# Altium schematic sheet LED-driver adjustable on UCC28810.SchDoc: LED-Driver "Aigul-50W" v.2
size 594 x 420 mm; ApprovedBy: Лазарев В.П.; DrawnBy: Лазарев В.П.; SheetTotal: 1; PageSetup: Record=PageOptions|CenterHorizontal=True|CenterVertical=True|PrintScale=0.70|XCorrection=1.00|YCorrection=1.00|PrintKind=0|BorderSize=5000000|LeftOffset=0|BottomOffset=0|Orientation=2|PaperLength=1000|PaperWidth=1000|Scale=100|PaperSource=260|PrintQuality=600|MediaType=1|DitherType=10|PaperKind=A3|PrintScaleMode=1
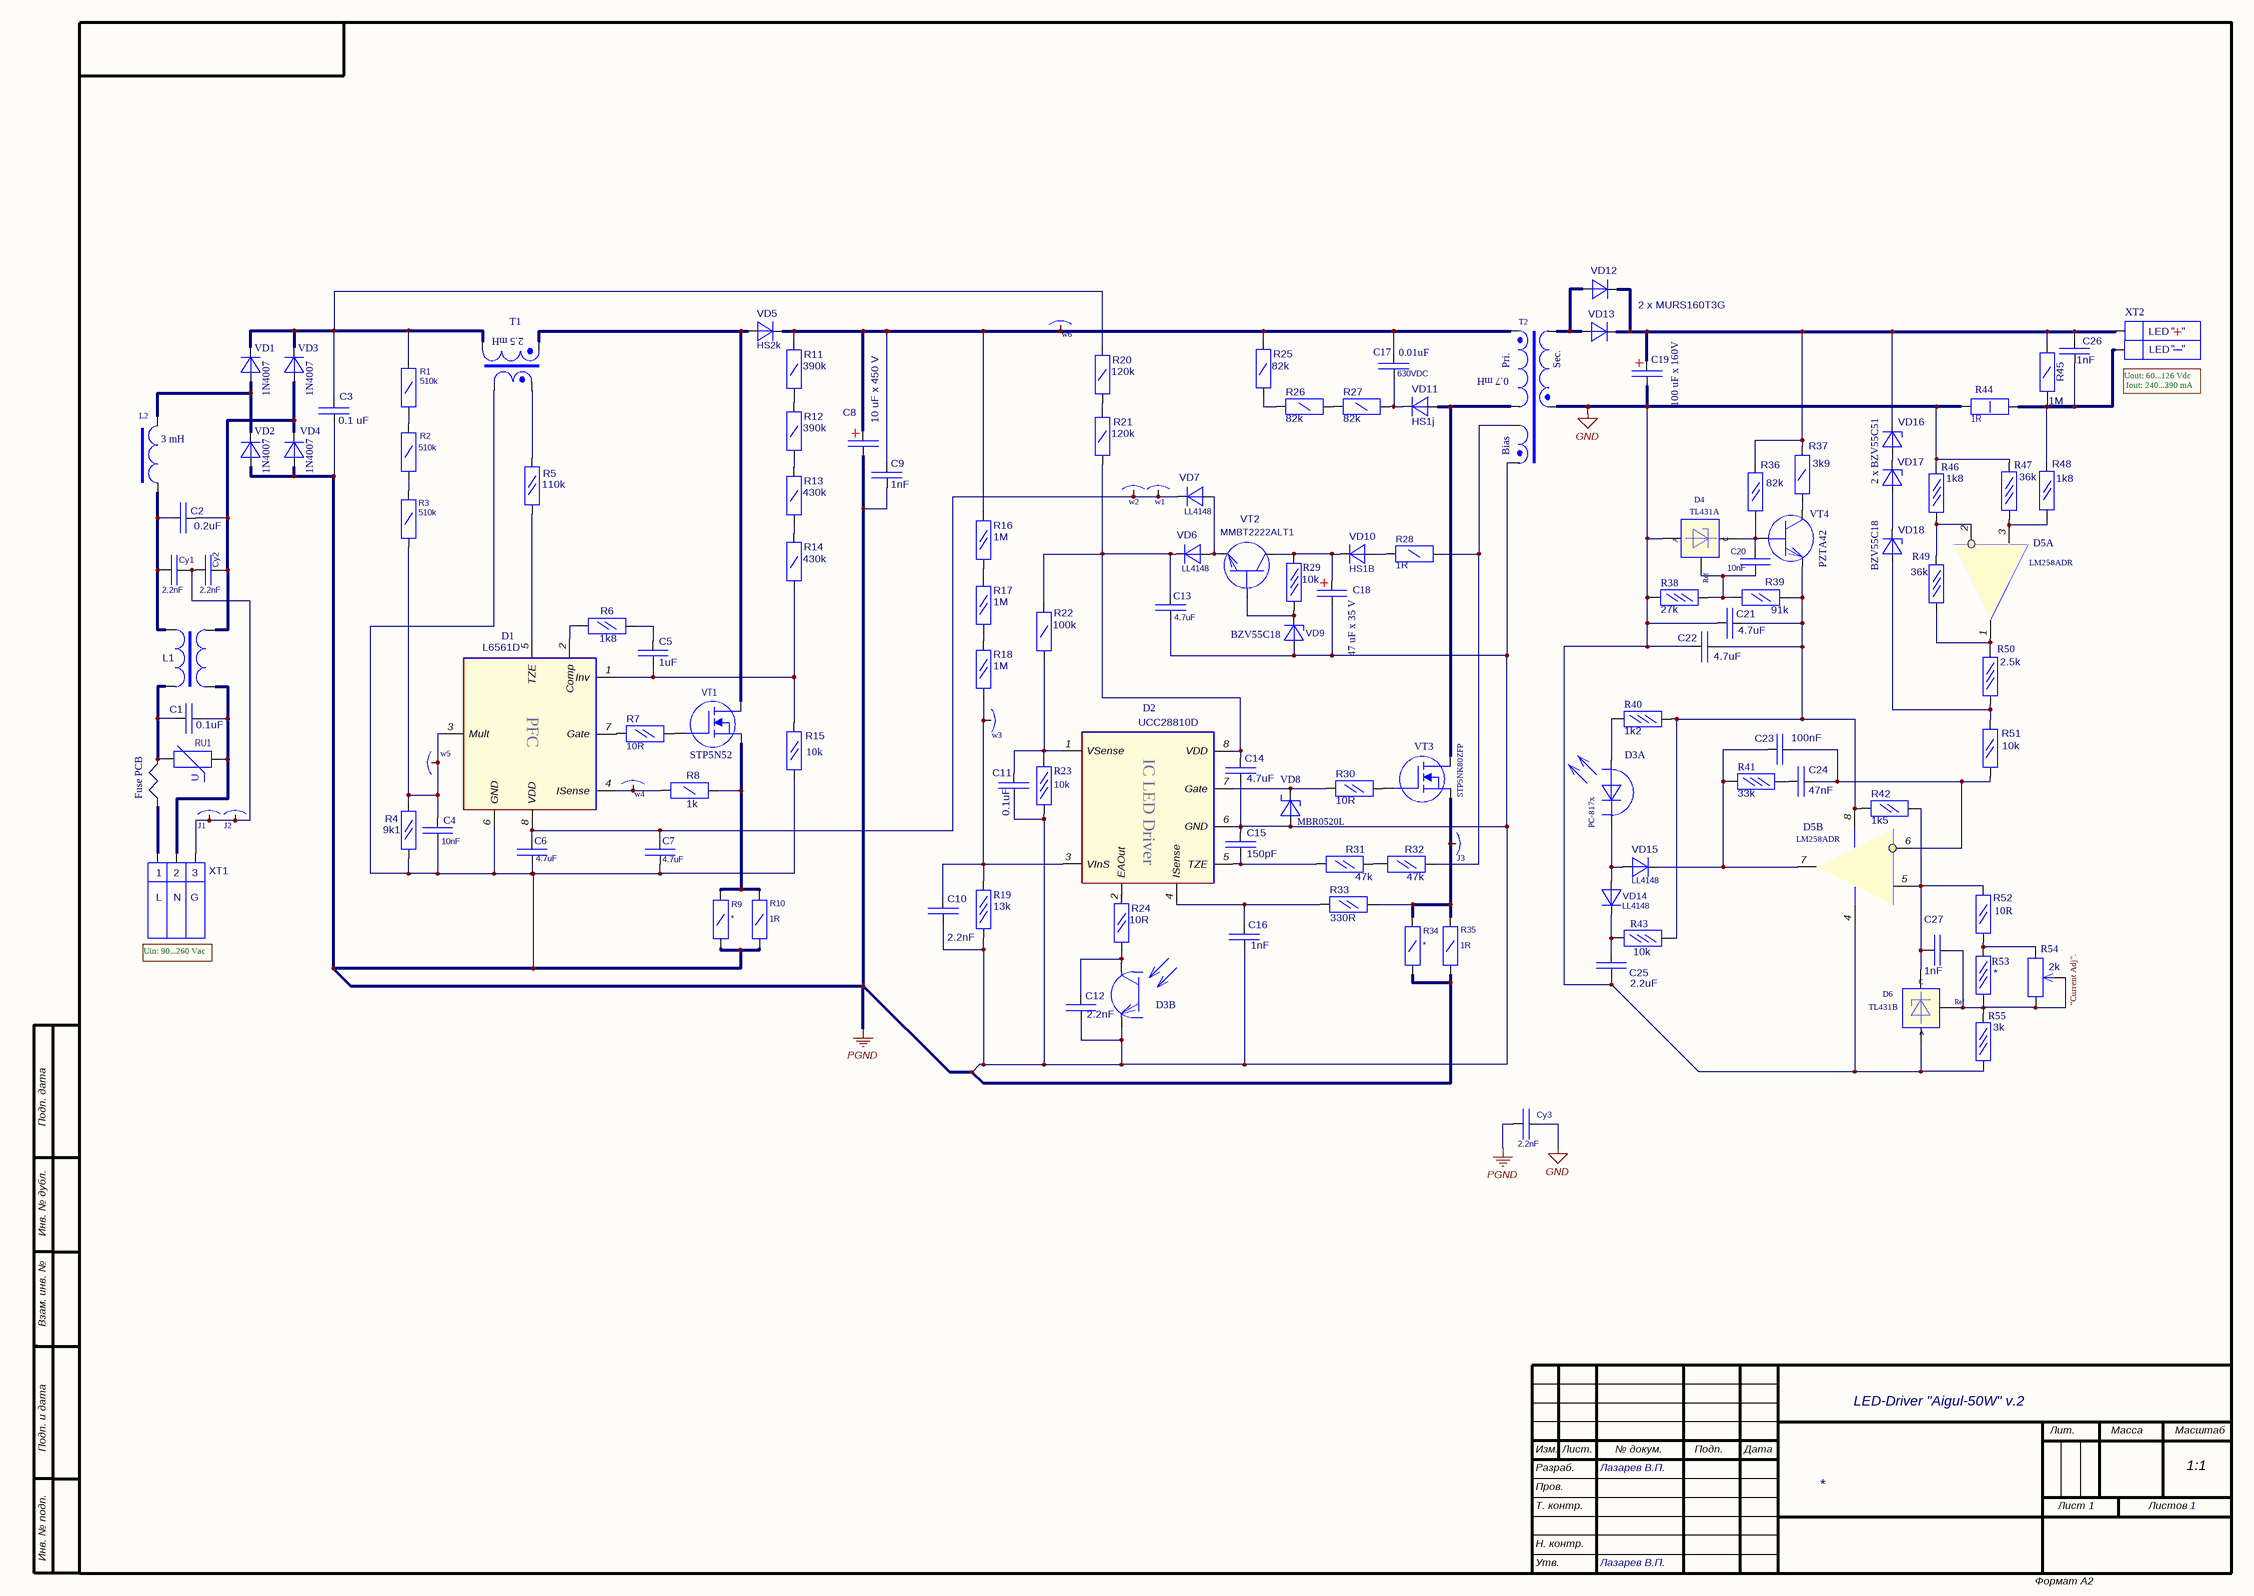
[diagram p0: LED-driver adjustable on UCC28810.SchDoc]

## Parts
C1  value 0.1uF  [CAPR9.0x18.0-15.0]  (hidden comment: Cap_MKP)
C2  value 0.2uF  [CAPR9.0x18.0-15.0]  (hidden comment: Cap_MKP)
C3  value 0.1 uF  [CAPR5.0x13.0-7.5]  (hidden comment: Cap1)
C4  value 10nF  [CAPC2012 (0805)]  (hidden comment: Cap_SMD)
C5  value 1uF  [1608[0603]]  (hidden comment: Cap_SMD)
C6  value 4.7uF  [CAPC2012 (0805)]  (hidden comment: Cap_SMD)
C7  value 4.7uF  [CAPC2012 (0805)]  (hidden comment: Cap_SMD)
C8  value 10 uF x 450 V  [CAPR E 10x12.5 pitch 5 - hor]  (hidden comment: Cap Pol)
C9  value 1nF  [CAPR5.0x13.0-5.0]  (hidden comment: Cap1)
C10  value 2.2nF  [1608[0603]]  (hidden comment: Cap_SMD)
C11  value 0.1uF  [1608[0603]]  (hidden comment: Cap_SMD)
C12  value 2.2nF  [1608[0603]]  (hidden comment: Cap_SMD)
C13  value 4.7uF  [CAPC2012 (0805)]  (hidden comment: Cap_SMD)
C14  value 4.7uF  [CAPC2012 (0805)]  (hidden comment: Cap_SMD)
C15  value 150pF  [1608[0603]]  (hidden comment: Cap_SMD)
C16  value 1nF  [1608[0603]]  (hidden comment: Cap_SMD)
C17  value 0.01uF  Voltage: 630VDC  [CAPC1812]  (hidden comment: Comment)
C18  value 47 uF x 35 V  [CAPR E 6.5x12, pitch 2.5]  (hidden comment: Comment)
C19  value 100 uF x 160V  [CAPR E 10x12.5 pitch 5 - hor]  (hidden comment: Cap Pol)
C20  value 10nF  [1608[0603]]  (hidden comment: Cap_SMD)
C21  value 4.7uF  [CAPC2012 (0805)]  (hidden comment: Cap_SMD)
C22  value 4.7uF  [CAPC3216N]  (hidden comment: Cap_SMD)
C23  value 100nF  [1608[0603]]  (hidden comment: Cap_SMD)
C24  value 47nF  [1608[0603]]  (hidden comment: Cap_SMD)
C25  value 2.2uF  [CAPC2012 (0805)]  (hidden comment: Cap_SMD)
C26  value 1nF  [CAPR5.0x13.0-5.0]  (hidden comment: Cap1)
C27  value 1nF  [CAPC2012 (0805)]  (hidden comment: Cap_SMD)
Cy1  value 2.2nF  [CAPR Y - 7.5]  (hidden comment: Cap (Y))
Cy2  value 2.2nF  [CAPR Y - 7.5]  (hidden comment: Cap (Y))
Cy3  value 2.2nF  [CAPR Y - 7.5]  (hidden comment: Cap (Y))
D1  value L6561D  [SO8_M]  (hidden comment: L6561)
D2  UCC28810D  [SO8_M]
D3  value PC-817x  [PC-817xx]  (hidden comment: Optocoupler)  (parts A,B of 2)
D4  value TL431A  [SOT-23_3D]  (hidden comment: TL431)
D5  value LM258ADR  [SO8_M]  (hidden comment: UCC28810D)  (parts A,B of 2)
D6  value TL431B  [SOT-23_3D]  (hidden comment: TL431)
J1  Jumper_1  [AXIAL- Jumper_9.5mm]  (value not drawn)  (net tie)
J2  Jumper_1  [AXIAL- Jumper_9.5mm]  (value not drawn)  (net tie)
J3  Jumper_1  [AXIAL- Jumper_15.0mm]  (value not drawn)  (net tie)
L1  Trans EMI  [YEE19-353D]  (value not drawn)
L2  3 mH  [Choke Barbell]
R1  value 510k  [RESC3216(1206)N]  (hidden comment: Res 1/4W)
R2  value 510k  [RESC3216(1206)N]  (hidden comment: Res 1/4W)
R3  value 510k  [RESC3216(1206)N]  (hidden comment: Res 1/4W)
R4  value 9k1  [RESC2012(0805)]  (hidden comment: Res 1/8W)
R5  value 110k  [RESC2012(0805)]  (hidden comment: Res 1/8W)
R6  value 1k8  [RESC2012(0805)]  (hidden comment: Res 1/8W)
R7  value 10R  [RESC2012(0805)]  (hidden comment: Res 1/8W)
R8  value 1k  [RESC3216(1206)N]  (hidden comment: Res 1/4W)
R9  Res 1/4W  [RESC3216(1206)N]  (value not drawn)
R10  value 1R  [RESC3216(1206)N]  (hidden comment: Res 1/4W)
R11  value 390k  [RESC3216(1206)N]  (hidden comment: Res 1/4W)
R12  value 390k  [RESC3216(1206)N]  (hidden comment: Res 1/4W)
R13  value 430k  [RESC3216(1206)N]  (hidden comment: Res 1/4W)
R14  value 430k  [RESC3216(1206)N]  (hidden comment: Res 1/4W)
R15  Value2: 10k  [RESC2012(0805)]  (hidden comment: Res 1/8W)
R16  value 1M  [RESC2012(0805)]  (hidden comment: Res 1/8W)
R17  value 1M  [RESC2012(0805)]  (hidden comment: Res 1/8W)
R18  value 1M  [RESC2012(0805)]  (hidden comment: Res 1/8W)
R19  value 13k  [RESC1608(0603)]  (hidden comment: Res 1/16W)
R20  value 120k  [RESC3216(1206)N]  (hidden comment: Res 1/4W)
R21  value 120k  [RESC3216(1206)N]  (hidden comment: Res 1/4W)
R22  value 100k  [RESC3216(1206)N]  (hidden comment: Res 1/4W)
R23  value 10k  [RESC1608(0603)]  (hidden comment: Res 1/16W)
R24  value 10R  [RESC2012(0805)]  (hidden comment: Res 1/8W)
R25  value 82k  [RESC3216(1206)N]  (hidden comment: Res 1/4W)
R26  value 82k  [RESC3216(1206)N]  (hidden comment: Res 1/4W)
R27  value 82k  [RESC3216(1206)N]  (hidden comment: Res 1/4W)
R28  value 1R  [RESC3216(1206)N]  (hidden comment: Res 1/4W)
R29  value 10k  [RESC1608(0603)]  (hidden comment: Res 1/16W)
R30  value 10R  [RESC2012(0805)]  (hidden comment: Res 1/8W)
R31  value 47k  [RESC2012(0805)]  (hidden comment: Res 1/8W)
R32  value 47k  [RESC2012(0805)]  (hidden comment: Res 1/8W)
R33  value 330R  [RESC2012(0805)]  (hidden comment: Res 1/8W)
R34  Res 1/4W  [RESC3216(1206)N]  (value not drawn)
R35  value 1R  [RESC3216(1206)N]  (hidden comment: Res 1/4W)
R36  value 82k  [RESC2012(0805)]  (hidden comment: Res 1/8W)
R37  value 3k9  [RESC3216(1206)N]  (hidden comment: Res 1/4W)
R38  value 27k  [RESC1608(0603)]  (hidden comment: Res 1/16W)
R39  value 91k  [RESC2012(0805)]  (hidden comment: Res 1/8W)
R40  value 1k2  [RESC1608(0603)]  (hidden comment: Res 1/16W)
R41  value 33k  [RESC1608(0603)]  (hidden comment: Res 1/16W)
R42  value 1k5  [RESC2012(0805)]  (hidden comment: Res 1/8W)
R43  value 10k  [RESC1608(0603)]  (hidden comment: Res 1/16W)
R44  value 1R  [RESC6332]  (hidden comment: Res 1W)
R45  value 1M  [RESC3216(1206)N]  (hidden comment: Res 1/4W)
R46  value 1k8  [RESC1608(0603)]  (hidden comment: Res 1/16W)
R47  value 36k  [RESC1608(0603)]  (hidden comment: Res 1/16W)
R48  value 1k8  [RESC2012(0805)]  (hidden comment: Res 1/8W)
R49  value 36k  [RESC1608(0603)]  (hidden comment: Res 1/16W)
R50  value 2.5k  [RESC1608(0603)]  (hidden comment: Res 1/16W)
R51  value 10k  [RESC2012(0805)]  (hidden comment: Res 1/8W)
R52  value 10R  [RESC2012(0805)]  (hidden comment: Res 1/8W)
R53  Res 1/16W  [RESC1608(0603)]  (value not drawn)
R54  value 2k  Function: "Current Adj".  [RES-Trim_3362H]  (hidden comment: Res Trimm)
R55  value 3k  [RESC1608(0603)]  (hidden comment: Res 1/16W)
RU1  Varistor  [VAristor 7.5-11x5]  (value not drawn)
T1  YEE25-2.5  [YEE25-2.5]  (value not drawn)
T2  FB-E25/50W  [FB-E25/50W]  (value not drawn)
VD1  value 1N4007  [CD4532-1812 (mod)]
VD2  value 1N4007  [CD4532-1812 (mod)]
VD3  value 1N4007  [CD4532-1812 (mod)]  (hidden comment: Diode HS1x)
VD4  value 1N4007  [CD4532-1812 (mod)]
VD5  value HS2k  [CD4532-1812 (mod)]  (hidden comment: Diode1)
VD6  value LL4148  [MELF-D3516-1406]  (hidden comment: Diode LL4148)
VD7  value LL4148  [MELF-D3516-1406]  (hidden comment: Diode LL4148)
VD8  value MBR0520L  [SOD123]  (hidden comment: Diode Schottky)
VD9  value BZV55C18  [MELF-D3516-1406]  (hidden comment: Diode Zener)
VD10  value HS1B  [CD4532-1812 (mod)]  (hidden comment: Diode1)
VD11  value HS1j  [CD4532-1812 (mod)]  (hidden comment: Diode1)
VD12  value 2 x MURS160T3G  [CD4532-1812 (mod)]  (hidden comment: Diode1)
VD13  Diode1  [CD4532-1812 (mod)]  (value not drawn)
VD14  value LL4148  [MELF-D3516-1406]  (hidden comment: Diode LL4148)
VD15  value LL4148  [MELF-D3516-1406]  (hidden comment: Diode LL4148)
VD16  value 2 x BZV55C51  [MELF-D3516-1406]  (hidden comment: Diode Zener)
VD17  Diode Zener  [MELF-D3516-1406]  (value not drawn)
VD18  value BZV55C18  [MELF-D3516-1406]  (hidden comment: Diode Zener)
VT1  value STP5N52  [D-PAK (TO252)]  (hidden comment: MOSFET-N1)
VT2  value MMBT2222ALT1  [SOT-23_3D]  (hidden comment: BC847)
VT3  value STP5NK80ZFP  [TO-220-AB (MOSFET)]  (hidden comment: MOSFET-N1)
VT4  PZTA42  [SOT223_M]
w1  Jumper_1  [Jumper-RES 0805]  (value not drawn)  (net tie)
w2  Jumper_1  [Jumper-RES 0805]  (value not drawn)  (net tie)
w3  Jumper_1  [Jumper-Res 1206]  (value not drawn)  (net tie)
w4  Jumper_1  [Jumper-Res 1206]  (value not drawn)  (net tie)
w5  Jumper_1  [Jumper-RES 0805]  (value not drawn)  (net tie)
w6  Jumper_1  [Jumper-Res 1206]  (value not drawn)  (net tie)
XT1  Connect x3  [ZIP-Ballast3]  (value not drawn)
XT2  Connect x2  [ZIP-Ballast2]  (value not drawn)

## Nets
GND: C19.2 C21.1 C22.2 C25.1 Cy3.2 D4.3(Anode) D5.4(V-) D6.3(Anode) R38.1 R44.1 R46.1 R47.1 R55.2 T2.6(Sec-)
PGND: C3.1 C4.1 C6.1 C7.1 C8.2 C9.2 C10.1 C11.1 C12.1 C13.1 C14.1 C15.1 C16.1 C18.2 Cy3.1 D1.6(GND) D2.6(GND) D3.3(Emitter) R4.2 R9.1 R10.1 R15.2 R19.2 R23.2 R34.1 R35.1 T1.4(Sec-) T2.5(TZE-) VD2.1 VD4.1 VD8.1(Anode) VD9.1
NetC1_1: C1.1 L1.4(Pri+) RU1.1 XT1.2
NetC1_2: C1.2 L1.1(Sec+) RU1.2 XT1.1
NetC2_1: C2.1 Cy2.2 L1.3(Pri-) VD3.1 VD4.2
NetC2_2: C2.2 Cy1.1 L1.2(Sec-) L2.1(Pri+)
NetC3_2: C3.2 R1.1 R20.2 T1.5(Pri-) VD1.2 VD3.2
NetC4_2: C4.2 D1.3(Mult) R3.2 R4.1 w5.1(W*)
NetC5_1: C5.1 R6.1
NetC5_2: C5.2 D1.1(Inv) R14.1 R15.1
NetC6_2: C6.2 C7.2 D1.8(VDD) VD7.2 w1.1(W*) w2.1(W*)
NetC8_1: C8.1 C9.1 C17.1 R11.2 R16.1 R25.2 T2.1(Pri-) VD5.2 w6.1(W*)
NetC10_2: C10.2 D2.3(VInS) R18.2 R19.1 w3.1(W*)
NetC11_2: C11.2 D2.1(VSense) R22.2 R23.1
NetC12_2: C12.2 D3.4(Collector) R24.2
NetC13_2: C13.2 C14.2 D2.8(VDD) R21.1 R22.1 VD6.2
NetC15_2: C15.2 D2.5(TZE) R31.1
NetC16_2: C16.2 D2.4(ISense) R33.1
NetC17_2: C17.2 R27.1 VD11.2
NetC18_1: C18.1 R29.1 VD10.2 VT2.3(C)
NetC19_1: C19.1 C26.2 R36.1 R37.2 R45.2 VD12.2 VD13.2 VD16.2 XT2.2
NetC20_1: C20.1 D4.1(Cathode) R36.2 VT4.1(B)
NetC20_2: C20.2 D4.2(Ref) R38.2 R39.1
NetC21_2: C21.2 C22.1 D5.8(V+) R39.2 R40.2 R42.2 R43.2 VT4.3(E)
NetC23_1: C23.1 C24.1 D5.6(IN-) R51.1
NetC23_2: C23.2 D5.7(OUT) R41.1 VD15.2
NetC24_2: C24.2 R41.2
NetC25_2: C25.2 R43.1 VD14.2
NetC26_1: C26.1 R44.2 R45.1 R48.1 XT2.1
NetC27_1: C27.1 D5.5(IN+) D6.1(Cathode) R42.1 R52.1
NetC27_2: C27.2 D6.2(Ref) R53.2 R54.2(WIPER) R54.3(CCW) R55.1
NetCy1_2: Cy1.2 Cy2.1 J1.1(W*) J2.1(W*) XT1.3
NetD1_2: D1.2(Comp) R6.2
NetD1_4: D1.4(ISense) R8.2 w4.1(W*)
NetD1_5: D1.5(TZE) R5.2
NetD1_7: D1.7(Gate) R7.2
NetD2_2: D2.2(EAOut) R24.1
NetD2_7: D2.7(Gate) R30.2 VD8.2(Catode)
NetD3_1: D3.1(Led_Anode) R40.1
NetD3_2: D3.2(Led_Cathode) VD14.1 VD15.1
NetD5_1: D5.1(OUT) R49.2 R50.1
NetD5_2: D5.2(IN-) R46.2 R49.1
NetD5_3: D5.3(IN+) R47.2 R48.2
NetJ3_1: J3.1(W*) R33.2 R34.2 R35.2 VT3.3(S)
NetL2_2: L2.2(Pri-) VD1.1 VD2.2
NetR1_2: R1.2 R2.1
NetR2_2: R2.2 R3.1
NetR5_1: R5.1 T1.1(Sec+)
NetR7_1: R7.1 VT1.1(G)
NetR8_1: R8.1 R9.2 R10.2 VT1.3(S)
NetR11_1: R11.1 R12.2
NetR12_1: R12.1 R13.2
NetR13_1: R13.1 R14.2
NetR16_2: R16.2 R17.1
NetR17_2: R17.2 R18.1
NetR20_1: R20.1 R21.2
NetR25_1: R25.1 R26.2
NetR26_1: R26.1 R27.2
NetR28_1: R28.1 R32.2 T2.4(TZE+)
NetR28_2: R28.2 VD10.1
NetR29_2: R29.2 VD9.2 VT2.1(B)
NetR30_1: R30.1 VT3.1(G)
NetR31_2: R31.2 R32.1
NetR37_1: R37.1 VT4.2(C)
NetR50_2: R50.2 R51.2 VD18.1
NetR52_2: R52.2 R53.1 R54.1(CW)
NetT1_8: T1.8(Pri+) VD5.1 VT1.2(D)
NetT2_3: T2.3(Pri+) VD11.1 VT3.2(D)
NetT2_10: T2.10(Sec+) VD12.1 VD13.1
NetVD6_1: VD6.1 VD7.1 VT2.2(E)
NetVD16_1: VD16.1 VD17.2
NetVD17_1: VD17.1 VD18.2

Not connected (* = marked no-connect by the designer): T1 6 7

## Notes on the sheet
- (near T1) 2.5 mH
- (near XT2) LED
- "
- +
- _
- (near T2) 0.7 mH
- (near T2) Pri.
- (near T2) Sec.
- (near XT2) Uout: 60...126 Vdc
  Iout: 240...390 mA
- (near T2) Bias
- (near RU1) Fuse PCB
- (near XT1) 1
- (near XT1) 2
- (near XT1) 3
- (near XT1) L
- (near XT1) N
- (near XT1) G
- Uin: 90...260 Vac
- Подп. дата
- Инв. № дубл.
- Взам. инв. №
- Подп. и дата
- Изм.
- Лист.
- № докум.
- Подп.
- Дата
- Лит.
- Масса
- Масштаб
- Разраб.
- Пров.
- Т. контр.
- Лист 1
- Листов
- 1:1
- Инв. № подп.
- Н. контр.
- Утв.
- Формат А2
- (in symbol TL431) A; C
- (in symbol Varistor) U

## Library data of the parts
C1 = Cap_MKP: Cap DIP (MKP); Voltage: 275VAC/400VDC; Function: EMI Filter; Tolerance: 20%; Dielectric: Polypropylene (MKP) - X2 class; PackageDescription: Radial, Thru-Hole Body 9.0x18.0x18.0mm(WxLxH), Pin Spacing 15.0mm; Supplier 1: *; Supplier Part Number 1: *
C2 = Cap_MKP: Cap DIP (MKP); Voltage: 275VAC/400VDV; Function: EMI Filter; Tolerance: 20%; Dielectric: Polypropylene (MKP) - X2 class; PackageDescription: Radial, Thru-Hole Body 9.0x18.0x18.0mm(WxLxH), Pin Spacing 15.0mm; Supplier 1: *; Supplier Part Number 1: *
C3 = Cap1: Capacitor GOST; Voltage: 400 VDC; Dielectric: Polypropylene Film; Tolerance: 10%; PackageDescription: Radial Capasitor
C4-C7 C10 C11 C13-C15 C21-C25 C27 = Cap_SMD: Ceramic; Voltage: 25Vdc; Tolerance %: 10%; Dielectric: X7R; Function: *; Supplier: *; Supplier Part Number: *
  C4 C13: PackageDescription: SMD CC1206/CC0805
  C5 C10 C11 C14 C15: PackageDescription: SMD CC0603
  C6 C7 C21-C25 C27: PackageDescription: SMD CC0805
C8 C18 = Cap Pol: Cap Pol GOST; Tolerance: 10%; Function: Electrolytic Aluminum Capasitor; Supplier: *; PackageDescription: Radial, Thru-Hole Body 13.0x25.0 (DxH)mm, Pin Spacing 5.0mm
C9 = Cap1: Capacitor GOST; Voltage: 1kV; Tolerance: 10 %; Dielectrik: Polypropyline Film; PackageDescription: Radial Capacitor; Package Reference: Capacitor class X 2,Thru-Hole Body 5.0 x 13.0 mm (WxT) Pin Spacing 5.0 mm; Function: *; Part Number: *; Supplier: *; Supplier Part Number: *
C12 C20 = Cap_SMD: Ceramic; Voltage: 25V; Tolerance %: 10%; Dielectric: X7R; PackageDescription: SMD CC0805; Function: *; Supplier: *; Supplier Part Number: *
C16 = Cap_SMD: Ceramic; Voltage: 50Vdc; Tolerance %: 10%; Dielectric: X7R; PackageDescription: SMD CC0603; Function: *; Supplier: *; Supplier Part Number: *
C17 = Cap1: Capacitor GOST; Tolerance: 10 %; Dielectrik: Ceramic; PackageDescription: SMD Capacitor; Package Reference: CC2220; Function: *; Part Number: *; Supplier: *; Supplier Part Number: *
C19 = Cap Pol: Cap Pol GOST; Tolerance: 10%; Function: 0; Supplier: *; PackageDescription: Radial, Thru-Hole Body 18.0x35.0 (DxH)mm, Pin Spacing 7.5mm
C26 = Cap1: Capacitor GOST; Voltage: 300Vdc; Tolerance: 10 %; Dielectrik: Polypropyline; PackageDescription: Radial Capacitor; Package Reference: Capacitor class X 2,Thru-Hole Body 5.0 x 13.0 mm (WxT) Pin Spacing 5.0 mm; Function: *; Part Number: *; Supplier: *; Supplier Part Number: *
Cy1-Cy3 = Cap (Y): Disc Ceramic; Voltage: 275VAC/400VDV; Function: Y-capacitor; Tolerance %: 20%; Dielectric: Ceramic Y1-class; PackageDescription: Radial, Disc Body , Pin Spacing 7.5mm; Supplier 1: *; Supplier Part Number 1: *
D1 = L6561: PFC; Functuion: PFC Controller; PackageReference: SOIC8; Supplier: STM
D2 = UCC28810D: IC LED Driver; Functuion: LED-Driver Controller; PackageReference: SOIC8; Supplier: Texac Instrument; Value: UCC28810D
D3 = Optocoupler: Phototransistor Optocoupler; Function: OptoIsolator/OptoCouple; PackageReference: SMD 4 pin
D4 = TL431: Prog Pre Ref_GOST; Function: Programmable Precision Reference; Tolerance: 1%; PackageReference: *; PackageDescription: SOT 23-3; Part Number: *
D5 = LM258ADR: Dual Operational Amplifier; Function: Low Power Dual OpAm; PackageDescription: SOIC-8 (8-Pin Small Outline Integrated Circuit 1.27 mm )
D6 = TL431: Prog Pre Ref_GOST; Function: Programmable Precision Reference; Tolerance: 0.5%; PackageReference: *; PackageDescription: SOT 23-3; Part Number: *
J1-J3 = Jumper_1: Jumper Wire; Function: Wire Jumper
  J1 J2: PackageDescription: Axial Jumper 9.5mm, Thru-Hole; 2 Leads
  J3: PackageDescription: Axial Jumper 15mm, Thru-Hole; 2 Leads
L1 = Trans EMI: Trans EMI (GOST); Function: EMI Filter; Value: YEE19-35D; Value2: 350mH; PackageDescription: *
L2 = Choke Barbell: Barbell 10 mm(d); PartNumber: IPK1016K302TU; Function: Choke EMI; PackageDescription: Barbell 11mm D; Value: 3 mH
R1-R3 R11-R14 = Res 1/4W: Resistor GOST; Tolerance: 5%; Voltage: 200Vdc; PackageReference: *; Function: *; Part Number: *
  R1-R3: PackageDescription: Chip Resistor, Body 3.2x1.6mm.
  R11-R14: PackageDescription: Chip Resistor, Body 3.2x1.6mm,
R4 = Res 1/8W: Resistor GOST; Tolerance: 1%; Voltage: 5Vdc; PackageDescription: Chip Resistor, Body 2.0x1.3mm,; PackageReference: *; Part Number: *
R5 R7 R30 R33 = Res 1/8W: Resistor GOST; Tolerance: 10%; Voltage: 50Vdc; PackageDescription: Chip Resistor, Body 2.0x1.3mm,; PackageReference: *; Part Number: *
R6 = Res 1/8W: Resistor GOST; Tolerance: 5%; Voltage: 25Vdc; PackageDescription: Chip Resistor, Body 2.0x1.3mm,; PackageReference: *; Part Number: *
R8 R22 R28 R35 = Res 1/4W: Resistor GOST; Tolerance: 10%; Voltage: 50Vdc; PackageDescription: Chip Resistor, Body 3.2x1.6mm.; PackageReference: *; Function: *; Part Number: *
R9 R34 = Res 1/4W: Resistor GOST; Tolerance: 10%; PackageDescription: Chip Resistor, Body 3.2x1.6mm.; PackageReference: *; Function: *; Part Number: *; Value: *
R10 = Res 1/4W: Resistor GOST; Tolerance: 5%; Voltage: 50Vdc; PackageDescription: Chip Resistor, Body 3.2x1.6mm.; PackageReference: *; Function: *; Part Number: *
R15 = Res 1/8W: Resistor GOST; Value: 10k6; Tolerance: 1%; Voltage: 50Vdc; PackageDescription: Chip Resistor, Body 2.0x1.3mm,; PackageReference: *; Part Number: *
R16-R18 = Res 1/8W: Resistor GOST; Tolerance: 5%; Voltage: 200Vdc; PackageDescription: Chip Resistor, Body 2.0x1.3mm,; PackageReference: *; Part Number: *
R19 R38 R41 R46 R47 R49 R50 = Res 1/16W: CR0603 GOST; Tolerance: 1%; Voltage: 25Vdc; PackageDescription: Chip 0603; PackageReference: RC0603; Part Number: *
R20 R21 = Res 1/4W: Resistor GOST; Tolerance: 10%; Voltage: 400Vdc; PackageDescription: Chip Resistor, Body 3.2x1.6mm,; PackageReference: *; Function: *; Part Number: *
R23 R40 = Res 1/16W: CR0603 GOST; Tolerance: 5%; Voltage: 25Vdc; PackageDescription: Chip 0603; PackageReference: RC0603; Part Number: *
R24 = Res 1/8W: Resistor GOST; Tolerance: 10%; Voltage: 25Vdc; PackageDescription: Chip Resistor, Body 2.0x1.3mm,; PackageReference: *; Part Number: *
R25-R27 R37 = Res 1/4W: Resistor GOST; Tolerance: 10%; Voltage: 200Vdc; PackageReference: *; Function: *; Part Number: *
  R25-R27: PackageDescription: Chip Resistor, Body 3.2x1.6mm,
  R37: PackageDescription: Chip Resistor, Body 3.2x1.6mm.
R29 R43 = Res 1/16W: CR0603 GOST; Tolerance: 10%; Voltage: 25Vdc; PackageDescription: Chip 0603; PackageReference: RC0603; Part Number: *
R31 R32 R39 R48 = Res 1/8W: Resistor GOST; Tolerance: 1%; Voltage: 50Vdc; PackageDescription: Chip Resistor, Body 2.0x1.3mm,; PackageReference: *; Part Number: *
R36 = Res 1/8W: Resistor GOST; Tolerance: 1%; Voltage: 200Vdc; PackageDescription: Chip Resistor, Body 2.0x1.3mm,; PackageReference: *; Part Number: *
R42 R51 R52 = Res 1/8W: Resistor GOST; Tolerance: 1%; Voltage: 25Vdc; PackageDescription: Chip Resistor, Body 2.0x1.3mm,; PackageReference: *; Part Number: *
R44 = Res 1W: Resistor GOST; PackageDescription: CR2512; PackageReference: *; Part Number: *
R45 = Res 1/4W: Resistor GOST; Tolerance: 1%; Voltage: 200Vdc; PackageDescription: Chip Resistor, Body 3.2x1.6mm,; PackageReference: *; Function: *; Part Number: *
R53 = Res 1/16W: CR0603 GOST; Tolerance: 1%; Voltage: 25Vdc; Value2: 3.9k; PackageDescription: Chip 0603; PackageReference: RC0603; Part Number: *; Value: *
R54 = Res Trimm: Res Trimm GOST; Part Number: 3362S-1-202LF; Manufacture: Bournce; Value2: 5k; PackageReference: *
R55 = Res 1/16W: CR0603 GOST; Tolerance: 1%; Voltage: 25Vdc; Value2: 2.9k; PackageDescription: Chip 0603; PackageReference: RC0603; Part Number: *
RU1 = Varistor: Varistor GOST; Part Number: ERZ-V05D471; Function: Transient Suppressor; Value: *; PackageReference: Varistor, Thru-Hole, Disc; Body 11 x 5 mm (LxW max) Pin Spacing 7.5 mm (typ)
T1 = PFC Choke F: Function: PFC Inductor; PackageDescription: E25/10/7, vert.; Value: YEE25-2.5
T2 = Trans FB-E25: FlyBack E25/50W; Function: FlyBack Transformer; Value2: LED-FB.E25-0.7mH-0.5g.H; PackageDescription: E25/13/7; Value: FB-E25/50W
VD1-VD4 = Diode1: Diode GOST; Function: Rectifier diode; Part Number: *; PackageDescription: Chip Diode; Body 4.5 x 3.2 mm (LxW typ); PackageReference: *
VD5 = Diode1: Diode GOST; Function: Super Fast Diode, 2A/800V; Value2: ES2k; Part Number: *; PackageDescription: Chip Diode; Body 4.5 x 3.2 mm (LxW typ); PackageReference: *
VD6 VD7 VD14 VD15 = Diode LL4148: Diode LL4148 (GOST); Part Number: *; Function: *
  VD6 VD7 VD15: Package Description: Metal Electrode Face (MELF) Diode; Body 3.5 x 1.7 mm (LxDia)
  VD14: Package Description: *
VD8 = Diode Schottky: Diode Schottky GOST; Function: Diode Schottky; PackageReference: *; PackageDescription: *; Part Number: *
VD9 VD18 = Diode Zener: Diode Zener GOST; Function: Zener Diode 18V, 5%; PackageReference: *; PackageDescription: Metal Electrode Face (MELF) Diode; Body 3.5 x 1.7 mm (LxDia); Part Number: *
VD10 = Diode1: Diode GOST; Function: Super Fast Diode, 1A/200V; Part Number: *; PackageDescription: Chip Diode; Body 4.5 x 3.2 mm (LxW typ); PackageReference: *
VD11 = Diode1: Diode GOST; Function: Super Fast Diode, 1A/400V; Part Number: *; PackageDescription: Chip Diode; Body 4.5 x 3.2 mm (LxW typ); PackageReference: *
VD12 = Diode1: Diode GOST; Function: Super Fast Diode, 2A/600V; Value2: 2 x HS2j; Part Number: *; PackageDescription: Chip Diode; Body 4.5 x 3.2 mm (LxW typ); PackageReference: *
VD13 = Diode1: Diode GOST; Value: MURS160T3G; Part Number: *; PackageDescription: Chip Diode; Body 4.5 x 3.2 mm (LxW typ); PackageReference: *; Function: *
VD16 = Diode Zener: Diode Zener GOST; Function: Zener Diode 51V, 5%; PackageReference: *; PackageDescription: Metal Electrode Face (MELF) Diode; Body 3.5 x 1.7 mm (LxDia); Part Number: *
VD17 = Diode Zener: Diode Zener GOST; Function: Zener Diode 51V; Value: BZV55C51; PackageReference: *; PackageDescription: Metal Electrode Face (MELF) Diode; Body 3.5 x 1.7 mm (LxDia); Part Number: *
VT1 = MOSFET-N1: N-Channel MOSFET GOST; Functioun: MOSFET N-channel 520V, 5A,1.6Ohm; PackageDescription: D-PAK (TO-252); PackageReference: *; Part Number: *
VT2 = BC847: NPN_SOT23; Functioun: Bipolar NPN; Vceo=40V; Ic=600mA; PackageDescription: SOT-23; PackageReference: *; Part Number: *
VT3 = MOSFET-N1: N-Channel MOSFET GOST; Functioun: MOSFET N-channel 800V, 5A,1.5Ohm; PackageDescription: *; PackageReference: *; Part Number: *
VT4 = PZTA42: NPN_SOT23; Functioun: Bipolar NPN; Vceo=300V; Ic=500mA; PackageDescription: SMD; PackageReference: SOT-233-3; Part Number: *; Value: PZTA42
w1-w6 = Jumper_1: Jumper Wire; Function: Chip Jumper
  w1 w2 w5: PackageDescription: Chip Body 0805 (2.0x1.3 mm.)
  w3 w4 w6: PackageDescription: Chip Body 1206 (3.2x1.6 mm.)
XT1 = Connect x3: Connect x3 GOST; Function: Input connector
XT2 = Connect x2: Connect x2 GOST